# Altium schematic sheet Sheet1.SchDoc
size A3; Date: 04.01.2021; Organization: Altium Limited; Address1: L3, 12a Rodborough Rd; Address2: Frenchs Forest; Address3: NSW; Address4: Australia 2086; SheetNumber: 1; SheetTotal: 2; Version: 1; Название устройства: TSAL_Main_Board
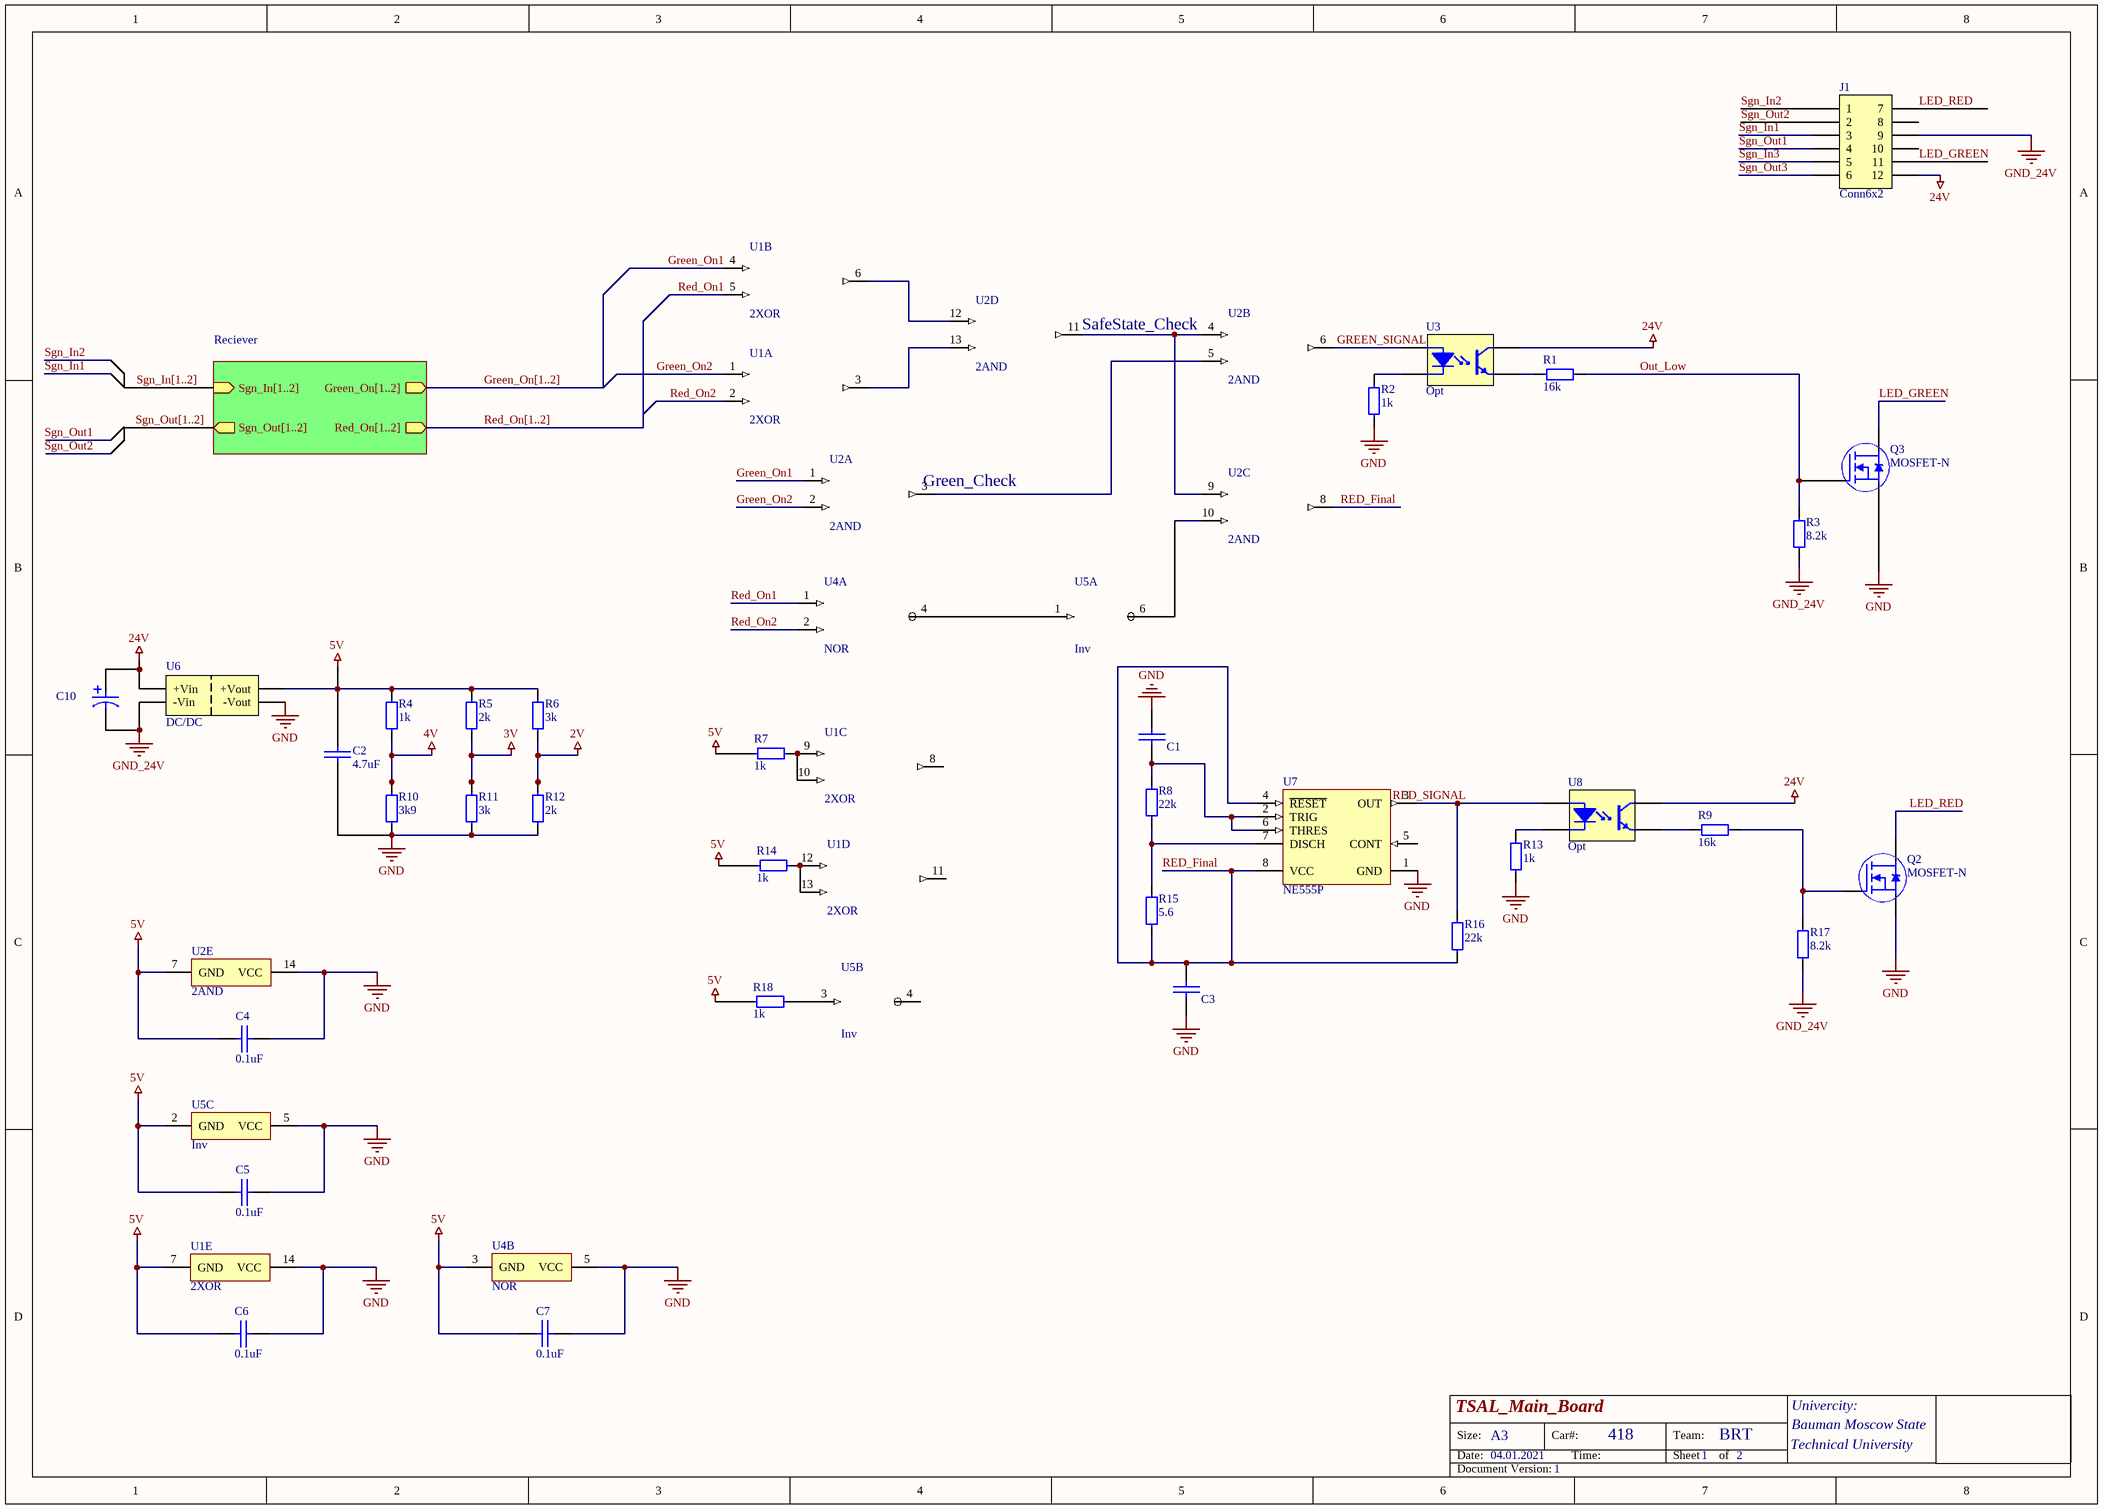
[diagram p0: Sheet1.SchDoc]

## Parts
C1  Cap 10nF (0805)  [0805 Capicator]  (value not drawn)
C2  4.7uF  [0603 Capicator]
C3  Cap 10nF (0805)  [0805 Capicator]  (value not drawn)
C4  0.1uF  [0805 Capicator]
C5  0.1uF  [0805 Capicator]
C6  0.1uF  [0805 Capicator]
C7  0.1uF  [0805 Capicator]
C10  Cap Pol 4.7uF  [Bar Cap 4x5.4]  (value not drawn)
J1  Conn6x2  [Conn6x2(Molex)]
Q2  MOSFET-N  [D-Pak (TO-252AA)]
Q3  MOSFET-N  [D-Pak (TO-252AA)]
R1  16k  [0603 Resistor]
R2  1k  [0603 Resistor]
R3  8.2k  [0603 Resistor]
R4  1k  [0603 Resistor]
R5  2k  [0603 Resistor]
R6  3k  [0603 Resistor]
R7  1k  [0603 Resistor]
R8  22k  [0603 Resistor]
R9  16k  [0603 Resistor]
R10  3k9  [0603 Resistor]
R11  3k  [0603 Resistor]
R12  2k  [0603 Resistor]
R13  1k  [0603 Resistor]
R14  1k  [0603 Resistor]
R15  5.6  [0603 Resistor]
R16  22k  [0603 Resistor]
R17  8.2k  [0603 Resistor]
R18  1k  [0603 Resistor]
U1  2XOR  [SOIC-14]  (parts A,B,C,D,E of 5)
U2  2AND  [SOIC-14]  (parts A,B,C,D,E of 5)
U3  Opt  [FAIR-MDIP-4_V]
U4  NOR  [SOT-23-5]  (parts A,B of 2)
U5  Inv  [SOT236]  (parts A,B,C of 3)
U6  DC/DC  [SIP7]
U7  NE555P  [SOIC-8]
U8  Opt  [FAIR-MDIP-4_V]

## Sub-sheets
Reciever = RelayDetect.SchDoc: Red_On[1..2] (out), Green_On[1..2] (out), Sgn_In[1..2] (in), Sgn_Out[1..2] (out)

## Nets
2V: R6.1 R12.2
3V: R5.1 R11.2
4V: R4.2 R10.2
5V: C2.2 C4.1 C5.1 C6.1 C7.1 R4.1 R5.2 R6.2 R7.2 R14.2 R18.2 U1.7(GND) U2.7(GND) U4.3(GND) U5.2(GND) U6.6(+Vout)
24V: C10.2 J1.12 U3.4(COLLECTOR) U6.1(+Vin) U8.4(COLLECTOR)
GND: C1.2 C2.1 C3.1 C4.2 C5.2 C6.2 C7.2 Q2.3(Source) Q3.3(Source) R2.1 R10.1 R11.1 R12.1 R13.1 U1.14(VCC) U2.14(VCC) U4.5(VCC) U5.5(VCC) U6.4(-Vout) U7.1(GND)
GND_24V: C10.1 J1.9 R3.1 R17.1 U6.2(-Vin)
Green_On1: U1.4(A) U2.1(A)
Green_On2: U1.1(A) U2.2(B)
GREEN_SIGNAL: U2.6(Y) U3.1(ANODE)
LED_GREEN: J1.11 Q3.2(Drain)
LED_RED: J1.7 Q2.2(Drain)
Out_Low: Q3.1(Gate) R1.2 R3.2
RED_Final: C3.2 R15.1 R16.1 U2.8(Y) U7.4(~{RESET}) U7.8(VCC)
Red_On1: U1.5(B) U4.1(A)
Red_On2: U1.2(B) U4.2(B)
RED_SIGNAL: R16.2 U7.3(OUT) U8.1(ANODE)
Sgn_In1: J1.3
Sgn_In2: J1.1
Sgn_In3: J1.5
Sgn_Out1: J1.4
Sgn_Out2: J1.2
Sgn_Out3: J1.6
NetC1_1: C1.1 R8.2 U7.2(TRIG) U7.6(THRES)
NetQ2_1: Q2.1(Gate) R9.2 R17.2
NetR1_1: R1.1 U3.3(EMITTER)
NetR2_2: R2.2 U3.2(CATHODE)
NetR7_1: R7.1 U1.9(A) U1.10(B)
NetR8_1: R8.1 R15.2 U7.7(DISCH)
NetR9_1: R9.1 U8.3(EMITTER)
NetR13_2: R13.2 U8.2(CATHODE)
NetR14_1: R14.1 U1.12(A) U1.13(B)
NetR18_1: R18.1 U5.3(A)
NetU1_3: U1.3(Y) U2.13(B)
NetU1_6: U1.6(Y) U2.12(A)
NetU2_3: U2.3(Y) U2.5(B)
NetU2_4: U2.4(A) U2.9(A) U2.11(Y)
NetU2_10: U2.10(B) U5.6(Y)
NetU4_4: U4.4(Y) U5.1(A)

Not connected (* = marked no-connect by the designer): J1 8 10; U1 8(Y) 11(Y); U5 4(Y); U7 5(CONT)

## Buses and harness runs
bus Green_On[1..2] = sheet Reciever/Green_On[1..2]
bus Red_On[1..2] = sheet Reciever/Red_On[1..2]
bus Sgn_In[1..2] = sheet Reciever/Sgn_In[1..2]
bus Sgn_Out[1..2] = sheet Reciever/Sgn_Out[1..2]

## Notes on the sheet
- (near U2) SafeState_Check
- (near U2) Green_Check
- Labels drawn without touching a wire or pin: Sgn_Out1, Sgn_Out2
- Size:
- Date:
- A3
- Car#:
- Time:
- 418
- Team:
- Sheet
- BRT
- of
- Technical University
- Univercity:
- Bauman Moscow State
- Document Version:

## Library data of the parts
C1 C3 = CMP-020-0006-1: 0805 X7R 10nF 100V 10%; Part Number: GRM21BR72A103KA01L; Manufacturer: Murata Manufacturing; Type: Capacitor; ComponentLink1Description: Chip&Dip; Component Type: Standard; Pins: 2; Source: Karen_Components.SchLib; ComponentLink1URL: https://www.chipdip.ru/product/grm21br72a103ka01l; Design Item ID: Cap 10nF (0805)
C2 = Cap 4.7uF (0603): 4.7uF X5R 6.3V 10% 0603; Manufacturer: Murata Manufacturing; Part Number: GRM188R60J475KE19D; Type: Capacitor; ComponentLink1Description: Chip&Dip; ComponentLink1URL: https://www.chipdip.ru/product/grm185r60g475me15d
C4-C7 = Cap 0.1uF (0805): 0.1uF X7R 50V 10% 0805; Manufacturer: Murata Manufacturing; Part Number: GRM21BR71E104KA01L; Type: Capacitor; ComponentLink1Description: Chip&Dip; ComponentLink1URL: https://www.chipdip.ru/product/grm21br71e104ka01l
C10 = CMP-020-0029-1: ECAP SMD,  35V, 105°C; Manufacturer: Epcos; Part Number: B41121A7475M000; Type: Capacitor; Design Item ID: Cap Pol 4.7uF; Source: Karen_Components.SchLib; ComponentLink1Description: Chip&Dip; Pins: 2; Component Type: Standard; ComponentLink1URL: https://www.chipdip.ru/product/b41121a7475m000
J1 = Conn 12 [Stack64]: Stac64 Right-Angle Header Assembly, 12 Circuits, Polarization A, Black, Tray / Current - Maximum per Contact 10.0A / Voltage - Maximum 500V; ComponentLink1Description: Molex; ComponentLink1URL: https://www.molex.com/molex/products/part-detail/pcb_headers/0346910120; ComponentLink2Description: DataSheet; ComponentLink2URL: https://www.molex.com/webdocs/datasheets/pdf/en-us/0346910120_PCB_HEADERS.pdf
Q2 Q3 = MOSFET-N [IRLR]: Trans MOSFET N-CH Si 55V 89A 3-Pin(2+Tab) DPAK Tube; Part Number: IRLR3705ZTRPBF; Manufacturer: International Rectifier; Type: Transistor; ComponentLink1Description: DataSheet; ComponentLink1URL: https://static.chipdip.ru/lib/292/DOC000292789.pdf; ComponentLink2Description: Chip&Dip; ComponentLink2URL: https://www.chipdip.ru/product/irlr3705zpbf
R1 R9 = Res 16k (0603): 0.1W 0603 16k, 1%; Manufacturer: Taiwan; Part number: RC0603FR-0716KL; ComponentLink1Description: Chip&Dip; ComponentLink1URL: https://www.chipdip.ru/product0/9000079741; ComponentLink2Description: Datasheet; ComponentLink2URL: https://static.chipdip.ru/lib/788/DOC004788200.pdf
R2 R4 R7 R13 R14 R18 = Res 1k (0603): 0.1W 0603 1k, 1%; Part Number: RC0603FR-071KL; Manufacturer: Taiwan; Type: Resistor; ComponentLink1Description: Chip&Dip; ComponentLink1URL: https://www.chipdip.ru/product0/9000079676
R3 R17 = Res 8.2k (0603): 0.1W 0603 8.2k, 1%; Manufacturer: Taiwan; Part number: RC0603FR-078R2L; ComponentLink1Description: Chip&Dip; ComponentLink1URL: https://www.chipdip.ru/product0/9000079556; ComponentLink2Description: Datasheet; ComponentLink2URL: ttps://static.chipdip.ru/lib/788/DOC004788200.pdf
R5 R12 = Res 2k (0603): 0.1W 0603 2k, 1%; Part Number: RC0603FR-072KL; Manufacturer: Taiwan; Type: Resistor; ComponentLink1Description: Chip&Dip; ComponentLink1URL: https://www.chipdip.ru/product0/9000079719
R6 R11 = Res 3k (0603): 0.1W 0603 3k, 1%; Part Number: RC0603FR-073KL; Manufacturer: Taiwan; Type: Resistor; ComponentLink1Description: Chip&Dip; ComponentLink1URL: https://www.chipdip.ru/product0/9000079723
R8 R16 = Res 22k (0.1W 0603 22k, 1%): 0.1W 0603 22k, 1%
R10 = Res 3.9k (0603): 0.1W 0603 3.9k, 1%; Part Number: RC0603FR-073K9L; Manufacturer: Taiwan; Type: Resistor; ComponentLink1Description: Chip&Dip; ComponentLink1URL: https://www.chipdip.ru/product0/9000079726
R15 = Res 5.6k (0.1W 0603 5.6k, 1%): 0.1W 0603 5.6k, 1%
U1 = 4 (2XOR): Chip&Dip: https://www.chipdip.ru/product/74hc86d
U2 = 4 (2AND): Chip&Dip: https://www.chipdip.ru/product/sn74ac08dr
U3 U8 = Optocoupler [FOD817B]: Phototransistor Optocoupler, 4 us Rise, 3 us Fall, 5000 Vrms, -55 to 110 degC, 4-Pin MDIP, RoHS, Tape and Reel; Manufacturer: ON Semiconductor; Part Nomber: FOD817B; ComponentLink1Description: Chip&Dip; ComponentLink1URL: https://www.chipdip.ru/product/fod817b; ComponentLink2Description: DataSheet; ComponentLink2URL: https://static.chipdip.ru/lib/297/DOC000297284.pdf
U5 = Inverter: Chip&Dip: https://www.chipdip.ru/product/sn74lvc2g04dbvr-2
U6 = DC/DC Isolated 5V [TMH]: The TMH series are ultra miniature, isolated 2 Watt DC/DC-converters in a Single-in-Line  package  (SIP); Manufacturer: Traco Power; Part Number: TMH2405S; ComponentLink1Description: Chip&Dip; ComponentLink1URL: https://www.chipdip.ru/product/tmh-2405s; ComponentLink2Description: DataSheet; ComponentLink2URL: https://static.chipdip.ru/lib/005/DOC001005854.pdf; Type: IC
U7 = NE555P: Standard Timer Single 8-Pin PDIP Tube; Manufacturer: Texas Instruments; Min Supply Voltage: 4.5V; Max Supply Voltage: 16V; Frequency: 500kHz; Number of Timers/Counters: 1; High Level Output Current: -200mA; Low Level Output Current: 200mA; Nominal Supply Current: 2mA; Operating Supply Current: 10mA; Quiescent Current: 15mA; Operating Supply Voltage: 5V; Supplier 1: Digi-Key; Manufacturer Part Number: NE555P; RoHS: Yes; Category: Clock and Timing; Pricing 1: 1=0,37000, 10=0,29900, 25=0,27360, 100=0,20350, 250=0,18444, 500=0,15264, 1000=0,11448, 2500=0,10494, 5000=0,10020 (USD); Mount: SMD; Case/Package: PDIP; Number of Pins: 8; Weight: 0.015535oz; Contact Plating: Gold; Min Operating Temperature: 0°C; Max Operating Temperature: 70°C; Packaging: Rail/Tube; Package Quantity: 50; Current Rating: 10mA; Length: 9.81mm; Width: 6.35mm; Height: 4.57mm; Radiation Hardening: No; Lead Free: Lead Free; RoHS Compliant: Yes; REACH SVHC: No SVHC; ComponentLink1URL: https://datasheet.ciiva.com/1139/sa555-1139904.pdf?src-supplier=Element14; ComponentLink1Description: https://datasheet.ciiva.com/1139/sa555-1139904.pdf?src-supplier=Element14; ComponentLink2URL: https://datasheet.ciiva.com/19457/904085-19457361.pdf?src-supplier=Jameco; ComponentLink2Description: https://datasheet.ciiva.com/19457/904085-19457361.pdf?src-supplier=Jameco; ComponentLink3URL: https://datasheet.ciiva.com/26325/152184-da-01-en-ne555p-timer-tid-26325915.pdf?src-supplier=Conrad; ComponentLink3Description: https://datasheet.ciiva.com/26325/152184-da-01-en-ne555p-timer-tid-26325915.pdf?src-supplier=Conrad; ComponentLink4URL: https://datasheet.ciiva.com/1147/1764032-1147750.pdf?src-supplier=Newark; ComponentLink4Description: https://datasheet.ciiva.com/1147/1764032-1147750.pdf?src-supplier=Newark; ComponentLink5URL: https://datasheet.ciiva.com/14094/ne555-series-eng-tds-14094950.pdf?src-supplier=Distrelec; ComponentLink5Description: https://datasheet.ciiva.com/14094/ne555-series-eng-tds-14094950.pdf?src-supplier=Distrelec; ComponentLink6URL: https://datasheet.ciiva.com/14274/ne555-14274456.pdf?src-supplier=Avnet; ComponentLink6Description: https://datasheet.ciiva.com/14274/ne555-14274456.pdf?src-supplier=Avnet; ComponentLink7URL: https://datasheet.ciiva.com/15152/getdatasheetpartid-248510-15152620.pdf?src-supplier=Verical; ComponentLink7Description: https://datasheet.ciiva.com/15152/getdatasheetpartid-248510-15152620.pdf?src-supplier=Verical; ComponentLink8URL: https://datasheet.ciiva.com/1233/ne555-1233454.pdf?src-supplier=Digi-Key; ComponentLink8Description: https://datasheet.ciiva.com/1233/ne555-1233454.pdf?src-supplier=Digi-Key; ComponentLink9URL: https://datasheet.ciiva.com/26228/ne555-26228892.pdf?src-supplier=Avnet+Europe; ComponentLink9Description: https://datasheet.ciiva.com/26228/ne555-26228892.pdf?src-supplier=Avnet+Europe
U4 = NOR: Chip&Dip: https://www.chipdip.ru/product/sn74lvc1g02dbvr-2